# EasyEDA Pro project ProPrj_picoballoon-tracker-v2_2025-12-21.epro, schematic Schematic1
Board Name: Board1; Create Date: 2025-08-09; Page Name: P1; Project Name: picoballoon-tracker-v2; Schematic Name: Schematic1; Update Date: 2025-10-24; Company: EasyEDA.com; Page Size: A4; Version: V1.0
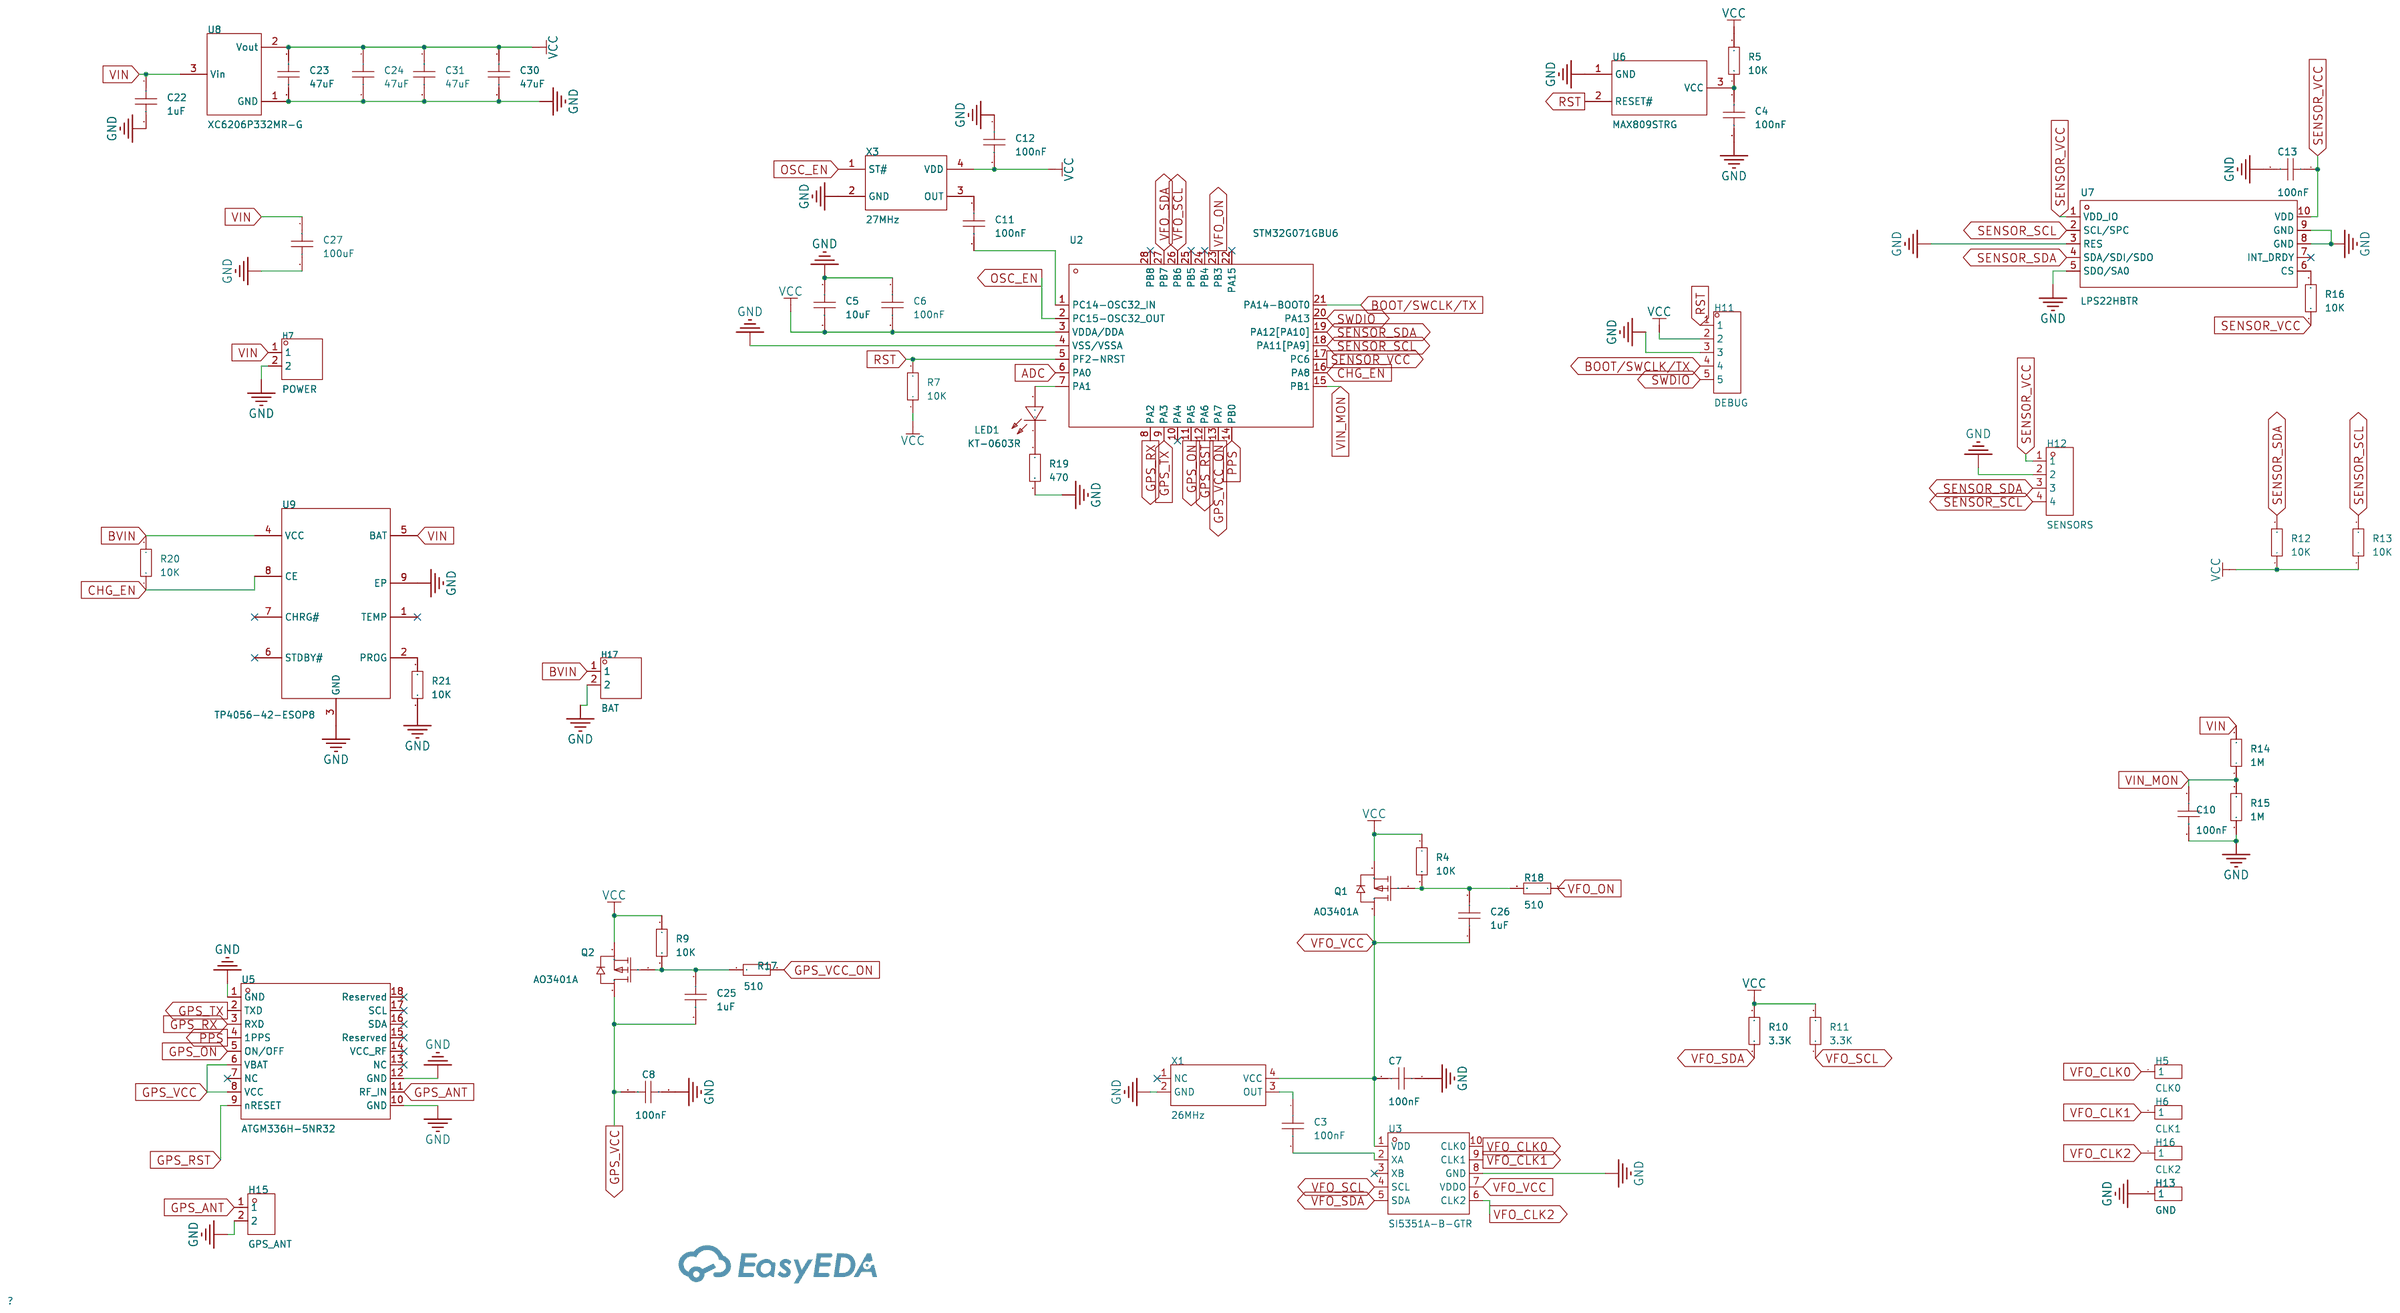
[diagram p0: schematic sheet]

## Parts
C3  100nF  [C0402]
C4  100nF  [C0402]
C5  10uF  [C0402]
C6  100nF  [C0402]
C7  100nF  [C0402]
C8  100nF  [C0402]
C10  100nF  [C0402]
C11  100nF  [C0402]
C12  100nF  [C0402]
C13  100nF  [C0402]
C22  1uF  [C0603]
C23  47uF  [C0805]
C24  47uF  [C0805]
C25  1uF  [C0402]
C26  1uF  [C0402]
C27  100uF  [C0805]
C30  47uF  [C0805]
C31  47uF  [C0805]
H5  CLK0  [HDR-TH_1P-V-M_XKB_X4611WV-01I-C28D40]
H6  CLK1  [HDR-TH_1P-V-M_XKB_X4611WV-01I-C28D40]
H7  POWER  [HDR-TH_2P-P2.54-V-M-1]
H11  DEBUG  [HDR-TH_5P-P2.54-V-M]
H12  SENSORS  [HDR-TH_ZX-PZ1.0-1-4PZZ]
H13  GND  [HDR-TH_1P-V-M_XKB_X4611WV-01I-C28D40]
H15  GPS_ANT  [HDR-TH_2P-P1.00-V-M]
H16  CLK2  [HDR-TH_1P-V-M_XKB_X4611WV-01I-C28D40]
H17  BAT  [HDR-TH_2P-P2.54-V-M-1]
LED1  KT-0603R  [LED0603-RD]
Q1  AO3401A  [SOT-23_L2.9-W1.3-P1.90-LS2.4-BR]
Q2  AO3401A  [SOT-23_L2.9-W1.3-P1.90-LS2.4-BR]
R4  10K  [R0402]
R5  10K  [R0402]
R7  10K  [R0402]
R9  10K  [R0402]
R10  3.3K  [R0402]
R11  3.3K  [R0402]
R12  10K  [R0402]
R13  10K  [R0402]
R14  1M  [R0402]
R15  1M  [R0402]
R16  10K  [R0402]
R17  510  [R0402]
R18  510  [R0402]
R19  470  [R0402]
R20  10K  [R0402]
R21  10K  [R0402]
U2  STM32G071GBU6  [UFQFPN-28_L4.0-W4.0-P0.50-BL]
U3  SI5351A-B-GTR  [MSOP-10_L3.0-W3.0-P0.50-LS5.0-BL]
U5  ATGM336H-5NR32  [GPS-SMD_18P-L10.1-W9.7-P1.10-TL]
U6  MAX809STRG  [SOT-23-3_L2.9-W1.6-P1.90-LS2.8-BR]
U7  LPS22HBTR  [HLGA-10L_LPS22HBTR]
U8  XC6206P332MR-G  [SOT-23-3_L2.9-W1.6-P1.90-LS2.8-BR]
U9  TP4056-42-ESOP8  [ESOP-8_L4.9-W3.9-P1.27-LS6.0-BL-EP]
X1  26MHz  [OSC-SMD_4P-L2.5-W2.0-BL_X1G0042110003]
X3  27MHz  [OSC-SMD_4P-L2.5-W2.0-BL_X1G0042110003]

## Library data of the parts
C3-C8 C10-C13 C25 C26 = CAP_0402: Supplier Part: C1525; Supplier Footprint: 0402
C22 = CAP_0603: Supplier Footprint: 0603
C23 C24 C27 C30 C31 = CAP_0805: Supplier Footprint: 0805
H5 H6 H13 H16 = HDR-M_2.54_1x1P: Supplier Footprint: Through
H7 H17 = HDR-M_2.54_1x2P: Supplier Footprint: Through
H11 = HDR-M_2.54_1x5P: Supplier Footprint: Through
H12 = ZX-PZ1.0-1-4PZZ: Pin Structure:1x4P Pitch:1mm Row Spacing:- Circluar Pins/Square Pins:Policy Mounting Type:Straight Number of Rows:Single Row Number of Pins:4P Current Rating:0.75A Length of Mating Pin:2mm Insulation Height:1mm Length of End Connection Pin:2mm Contact Mat; LCSC Part Name: 1x4P 间距:1mm 方针 直插; Supplier Part: C37328854; Manufacturer: Megastar(兆星); Supplier Footprint: 插件,P=1mm; JLCPCB Part Class: Extended Part; Datasheet: https://atta.szlcsc.com/upload/public/pdf/source/20240812/85F48A99F7C6AED78605DAA33CDE8A90.pdf; Supplier: LCSC; Pin Structure: 1x4P; Pitch: 1mm; Circluar Pins/Square Pins: Policy; Mounting Type: Straight; Number of Rows: Single Row; Number of Pins: 4P; Current Rating: 0.75A; Length of Mating Pin: 2mm; Insulation Height: 1mm; Length of End Connection Pin: 2mm; Contact Material: Brass; Contact Plating: Gold; Operating Temperature: -40℃~+105℃; Color: Black
H15 = A100UP-ZD2P: Pin Structure:1x2P Pitch:1mm Row Spacing:- Circluar Pins/Square Pins:Policy Number of Rows:Single Row Number of Pins:2P Current Rating:0.75A Length of Mating Pin:2mm Insulation Height:1mm Operating Temperature:-40℃~+105℃ Operating Temperature:-40℃~+105℃; LCSC Part Name: 1x2P 间距:1mm 方针; Supplier Part: C32713045; Manufacturer: BXCONN(宝讯); Supplier Footprint: 插件,P=1mm; JLCPCB Part Class: Extended Part; Datasheet: https://atta.szlcsc.com/upload/public/pdf/source/20240723/7827636EC4017AF937C0598DF75E6B3B.pdf; Supplier: LCSC; Pin Structure: 1x2P; Pitch: 1mm; Circluar Pins/Square Pins: Policy; Number of Rows: Single Row; Number of Pins: 2P; Current Rating: 0.75A; Length of Mating Pin: 2mm; Insulation Height: 1mm; Operating Temperature: -40℃~+105℃
LED1 = KT-0603R: Emitted Color:Red Power Dissipation:- Forward Current:- Dominant Wavelength:- Dominant Wavelength:- Peak Wavelength:- Diode Configuration:- Lens Color:- Color Temperature:- Color Temperature:- Viewing Angle:- Mounting Sytle:- Operating Temperature:-40℃~+8; LCSC Part Name: 0603 红灯 高亮; Supplier Part: C2286; Manufacturer: KENTO; Supplier Footprint: 0603; JLCPCB Part Class: Basic Part; Datasheet: https://atta.szlcsc.com/upload/public/pdf/source/20160616/1466072038404.pdf; Supplier: LCSC; Emitted Color: Red; Operating Temperature: -40℃~+85℃
Q1 Q2 = AO3401A_C15127: Type:1 Piece P-Channel Drain Source Voltage (Vdss): Continuous Drain Current (Id): Drain Source On Resistance (RDS(on)@Vgs,Id):44mΩ@10V,4.3A Power Dissipation (Pd): Gate Threshold Voltage (Vgs(th)@Id):1.3V@250uA Total Gate Charge (Qg@Vgs):12.2nC@4.5V Inpu; LCSC Part Name: 1个P沟道 耐压:30V 电流:4A; Supplier Part: C15127; Manufacturer: AOS; Supplier Footprint: SOT-23; JLCPCB Part Class: Basic Part; Datasheet: https://atta.szlcsc.com/upload/public/pdf/source/20160507/1462613609053.pdf; Supplier: LCSC; Type: 1 Piece P-Channel; Drain Source On Resistance (RDS(on)@Vgs,Id): 44mΩ@10V,4.3A; Gate Threshold Voltage (Vgs(th)@Id): 1.3V@250uA; Total Gate Charge (Qg@Vgs): 12.2nC@4.5V; Input Capacitance (Ciss@Vds): 1.2nF@15V; Operating Temperature: -55℃~+150℃@(Tj)
R4 R5 R7 R9-R21 = Res_0402: Supplier Footprint: 0402
U2 = STM32G071GBU6: CPU Core:ARM-MSeries CPU Maximum Speed:64MHz Program Storage Size:128KB Program Memory Type:FLASH Number of I/O:26 ADC (Bit):12bit DAC (Bit):12bit Low Voltage Detection Threshold:1.71V~3.6V Low Voltage Detection Threshold:1.71V~3.6V Application Area:-; LCSC Part Name: 主流Arm Cortex-M0+ MCU，具有128 KB Flash存储器、36 KB RAM、64 MHz CPU、4x USART、定时器、ADC、DAC和通信接口，1.7-3.6V; Supplier Part: C529347; Manufacturer: ST(意法半导体); Supplier Footprint: UFQFPN-28(4x4); JLCPCB Part Class: Extended Part; Datasheet: https://atta.szlcsc.com/upload/public/pdf/source/20200511/C529341_B4645443CFA701032F4478EC9851D5EF.pdf; Supplier: LCSC; CPU Core: ARM-MSeries; CPU Maximum Speed: 64MHz; Program Storage Size: 128KB; Program Memory Type: FLASH; Number of I/O: 26; ADC (Bit): 12bit; DAC (Bit): 12bit; Low Voltage Detection Threshold: 1.71V~3.6V
U3 = SI5351A-B-GTR: Interface:I2C Output Frequency (Max):200MHz Supply Voltage:2.25V~3.6V Supply Voltage:2.25V~3.6V Input Low Voltage:990mV Input Low Voltage:990mV Intput High Voltage:1.75V~3.6V Intput High Voltage:1.75V~3.6V Output Low Voltage:600mV Output Low Voltage:600mV; Supplier Part: C504891; Manufacturer: SKYWORKS/SILICON LABS(芯科); Supplier Footprint: MSOP-10; JLCPCB Part Class: Extended Part; Datasheet: https://atta.szlcsc.com/upload/public/pdf/source/20201217/C504891_43D9F8D26F790B9DA481E85A362B0988.pdf; Supplier: LCSC; Interface: I2C; Output Frequency (Max): 200MHz; Supply Voltage: 2.25V~3.6V; Input Low Voltage: 990mV; Intput High Voltage: 1.75V~3.6V; Output Low Voltage: 600mV; Output High Voltage: 1.9V; Operating Temperatue: -55℃~+150℃
U5 = ATGM336H-5NR32: Supplier Part: C5117921; Manufacturer: 杭州中科微; Supplier Footprint: LCC-18(10.1x9.7); JLCPCB Part Class: Extended Part; Datasheet: https://atta.szlcsc.com/upload/public/pdf/source/20230625/BFC2F030748B2EE61697AE064B3C32F1.pdf; Supplier: LCSC
U6 = MAX809STRG: ChipType:Voltage monitor Output Type:Push-Pull Voltage - Supply:1V~5.5V Voltage - Supply:1V~5.5V Reset Active Level:Active Low Threshold Voltage:2.93V Number of Voltages Monitored:1 Manual Reset:No Watchdog:No Reset Timeout:140ms Operating Temperature:-40; Supplier Part: C9965; Manufacturer: onsemi(安森美); Supplier Footprint: SOT-23; JLCPCB Part Class: Extended Part; Datasheet: https://atta.szlcsc.com/upload/public/pdf/source/20170628/1498635293483.PDF; Supplier: LCSC; ChipType: Voltage monitor; Output Type: Push-Pull; Voltage - Supply: 1V~5.5V; Reset Active Level: Active Low; Threshold Voltage: 2.93V; Number of Voltages Monitored: 1; Manual Reset: No; Watchdog: No; Reset Timeout: 140ms; Operating Temperature: -40℃~+125℃@(TJ)
U7 = LPS22HBTR: Pressure range:26Kpa~126Kpa Pressure range:26Kpa~126Kpa The Power Supply Voltage:1.7V~3.6V The Power Supply Voltage:1.7V~3.6V Operating Temperature:-40℃~+85℃ Operating Temperature:-40℃~+85℃; Supplier Part: C94049; Manufacturer: ST(意法半导体); Supplier Footprint: HLGA-10(2x2); JLCPCB Part Class: Extended Part; Datasheet: https://atta.szlcsc.com/upload/public/pdf/source/20170908/C94049_1504870171328958154.pdf; Supplier: LCSC; Pressure range: 26Kpa~126Kpa; The Power Supply Voltage: 1.7V~3.6V; Operating Temperature: -40℃~+85℃
U8 = XC6206P332MR-G_C5446: Output Type:Fixed Voltage - Supply:6V Output Voltage:3.3V Output Voltage:3.3V Output Current:200mA Power Supply Rejection Ratio (PSRR):- Voltage Dropout:- standby current:1uA Features:Over Current Protection Operating Temperature:-40℃~+85℃@(Ta) Operating; LCSC Part Name: 输入6V 输出3.3V 200mA; Supplier Part: C5446; Manufacturer: TOREX(特瑞仕); Supplier Footprint: SOT-23-3L; JLCPCB Part Class: Basic Part; Datasheet: https://item.szlcsc.com/datasheet/XC6206P332MR-G/5896.html; Supplier: LCSC; Output Type: Fixed; Voltage - Supply: 6V; Output Voltage: 3.3V; Output Current: 200mA; standby current: 1uA; Features: Over Current Protection; Operating Temperature: -40℃~+85℃@(Ta); Output Configuration: Positive; Number of Outputs: 1
U9 = TP4056-42-ESOP8: The Chip Type:Linear Charging IC Voltage - Supply:4V~8V Voltage - Supply:4V~8V Charge Current - Max:1A Charging Saturation Voltage:4.2V End-Off Voltage:- Type of Battery:Lithium-ion/Polymer Number of Cells:1 Number of Cells:1 Operating Temperature:-40℃~+8; LCSC Part Name: 单节锂离子电池线性充电器; Supplier Part: C16581; Manufacturer: TOPPOWER(南京拓微); Supplier Footprint: ESOP-8; JLCPCB Part Class: Extended Part; Datasheet: https://item.szlcsc.com/datasheet/TP4056-42-ESOP8/17264.html; Supplier: LCSC; The Chip Type: Linear Charging IC; Voltage - Supply: 4V~8V; Charge Current - Max: 1A; Charging Saturation Voltage: 4.2V; Type of Battery: Lithium-ion/Polymer; Number of Cells: 1; Operating Temperature: -40℃~+85℃
X1 = X1G0042110003_C3013793: Frequency:26MHz Output Type:Peak Shaving Sine Wave Voltage - Supply:2.85V~3.15V Voltage - Supply:2.85V~3.15V Current - Supply:1.5mA Operating Temperature:-30℃~+85℃ Operating Temperature:-30℃~+85℃; LCSC Part Name: 26MHz 2.85V~3.15V; Supplier Part: C3013793; Manufacturer: EPSON(爱普生); Manufacturer Part: X1G0042110003; Supplier Footprint: SMD2520-6P; JLCPCB Part Class: Extended Part; Datasheet: https://atta.szlcsc.com/upload/public/pdf/source/20240417/EAF55A82FF3095CB5EF33A849766E589.pdf; Supplier: LCSC; Output Type: Peak Shaving Sine Wave; Voltage - Supply: 2.85V~3.15V; Current - Supply: 1.5mA; Operating Temperature: -30℃~+85℃
X3 = X1G0041710035: Frequency:27MHz Normal temperature Frequency Tolerance:±50ppm Normal temperature Frequency Tolerance:±50ppm Output Type:CMOS Voltage - Supply:1.62V~3.63V Voltage - Supply:1.62V~3.63V Current - Supply:2.2mA Frequency Stability:±100ppm Frequency Stability:±; LCSC Part Name: X1G004171003500; Supplier Part: C70561; Manufacturer: EPSON(爱普生); Supplier Footprint: SMD2520-4P; JLCPCB Part Class: Extended Part; Datasheet: https://atta.szlcsc.com/upload/public/pdf/source/20240417/47940C32A3C2F3577A44F4AE7844618E.pdf; Supplier: LCSC; Normal temperature Frequency Tolerance: ±50ppm; Output Type: CMOS; Voltage - Supply: 1.62V~3.63V; Current - Supply: 2.2mA; Frequency Stability: ±100ppm; Operating Temperature: -40℃~+85℃

## Nets
GND: C4.2 C5.1 C6.1 C7.1 C8.2 C10.2 C12.1 C13.2 C22.2 C23.2 C24.2 C27.2 C30.2 C31.2 H7.2 H11.3 H12.2 H13.1 H15.2 H17.2 R15.1 R19.2 R21.1 U2.4(VSS/VSSA) U3.8(GND) U5.1(GND) U5.10(GND) U5.12(GND) U6.1(GND) U7.3(RES) U7.5(SDO/SA0) U7.8(GND) U7.9(GND) U8.1(GND) U9.3(GND) U9.9(EP) X1.2(GND) X3.2(GND)
VCC: C5.2 C6.2 C12.2 C23.1 C24.1 C30.1 C31.1 H11.2 Q1.2(S) Q2.2(S) R4.1 R5.2 R7.1 R9.1 R10.2 R11.2 R12.1 R13.1 U2.3(VDDA/DDA) U8.2(Vout) X3.4(VDD)
VIN: C22.1 C27.1 H7.1 R14.2 U8.3(Vin) U9.5(BAT)
VIN_MON: C10.1 R14.1 R15.2 U2.15(PB1)
ADC: U2.6(PA0)
BOOT/SWCLK/TX: H11.4 U2.21(PA14-BOOT0)
BVIN: H17.1 R20.2 U9.4(VCC)
CHG_EN: R20.1 U2.16(PA8) U9.8(CE)
GPS_ANT: H15.1 U5.11(RF_IN)
GPS_ON: U2.11(PA5) U5.5(ON/OFF)
GPS_RST: U2.12(PA6) U5.9(nRESET)
GPS_RX: U2.8(PA2) U5.3(RXD)
GPS_TX: U2.9(PA3) U5.2(TXD)
GPS_VCC: C8.1 C25.2 Q2.3(D) U5.6(VBAT) U5.8(VCC)
GPS_VCC_ON: R17.2 U2.13(PA7)
OSC_EN: U2.2(PC15-OSC32_OUT) X3.1(ST#)
PPS: U2.14(PB0) U5.4(1PPS)
RST: H11.1 R7.2 U2.5(PF2-NRST) U6.2(RESET#)
SENSOR_SCL: H12.4 R13.2 U2.18(PA11[PA9]) U7.2(SCL/SPC)
SENSOR_SDA: H12.3 R12.2 U2.19(PA12[PA10]) U7.4(SDA/SDI/SDO)
SENSOR_VCC: C13.1 H12.1 R16.1 U2.17(PC6) U7.1(VDD_IO) U7.10(VDD)
SWDIO: H11.5 U2.20(PA13)
VFO_CLK0: H5.1 U3.10(CLK0)
VFO_CLK1: H6.1 U3.9(CLK1)
VFO_CLK2: H16.1 U3.6(CLK2)
VFO_ON: R18.1 U2.23(PB3)
VFO_SCL: R11.1 U2.26(PB6) U3.4(SCL)
VFO_SDA: R10.1 U2.27(PB7) U3.5(SDA)
VFO_VCC: C7.2 C26.1 Q1.3(D) U3.1(VDD) U3.7(VDDO) X1.4(VCC)
$1N1023: C11.2 U2.1(PC14-OSC32_IN)
$1N1361: C3.1 X1.3(OUT)
$1N1366: C3.2 U3.2(XA)
$1N13574: C4.1 R5.1 U6.3(VCC)
$1N14906: R16.2 U7.6(CS)
$1N19967: C11.1 X3.3(OUT)
$1N21669: C25.1 Q2.1(G) R9.2 R17.1
$1N21797: C26.2 Q1.1(G) R4.2 R18.2
$1N29798: LED1.1(K) R19.1
$1N29803: LED1.2(A) U2.7(PA1)
$1N31369: R21.2 U9.2(PROG)

Not connected (* = marked no-connect by the designer): U2 10(PA4)* 22(PA15)* 24(PB4)* 25(PB5)* 28(PB8)*; U3 3(XB)*; U5 7(NC)* 13(NC)* 14(VCC_RF)* 15(Reserved)* 16(SDA)* 17(SCL)* 18(Reserved)*; U7 7(INT_DRDY)*; U9 1(TEMP)* 6(STDBY#)* 7(CHRG#)*; X1 1(NC)*
